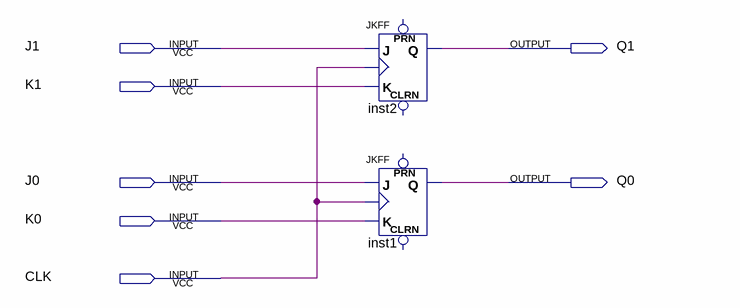
[diagram p0: schematic sheet]
// Quartus schematic MODULE_2.bdf as structural Verilog: 2 symbols, 7 pins
module MODULE_2 (
  input  J1,
  input  K1,
  input  J0,
  input  K0,
  input  CLK,
  output Q1,
  output Q0
);

  JKFF inst2 (.K(K1), .J(J1), .CLK(CLK), .Q(Q1));  // open: PRN, CLRN
  JKFF inst1 (.K(K0), .J(J0), .CLK(CLK), .Q(Q0));  // open: PRN, CLRN
endmodule
